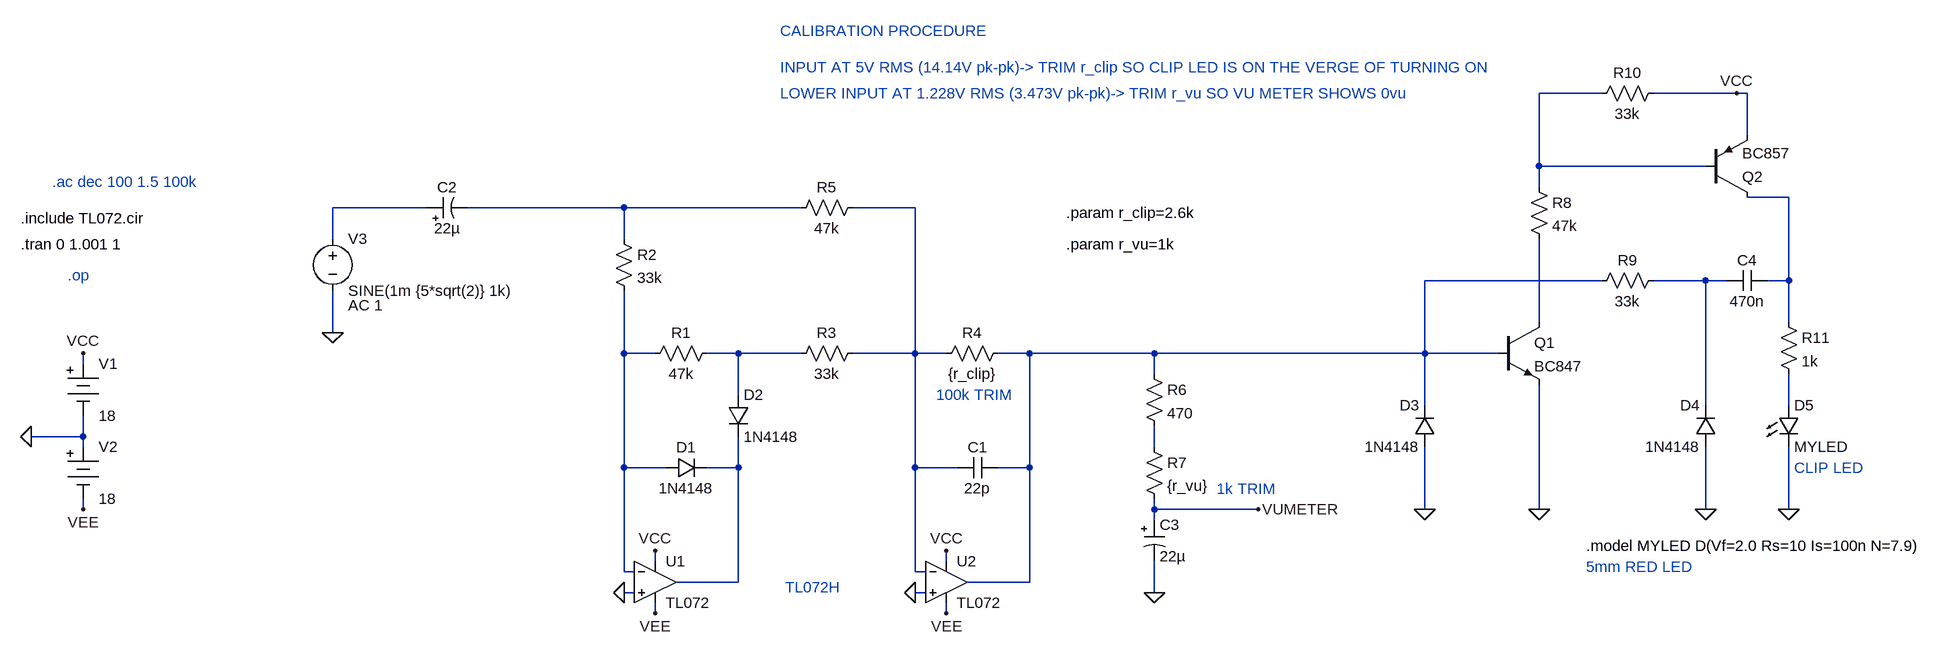
[diagram p0: schematic sig_peak_vumeter.asc]
sig_peak_vumeter.asc, the LTspice schematic file:
Version 4
SHEET 1 3308 796
WIRE 2368 -80 2272 -80
WIRE 2576 -80 2448 -80
WIRE 2592 -80 2576 -80
WIRE 2592 -16 2592 -80
WIRE 2272 32 2272 -80
WIRE 2528 32 2272 32
WIRE 2272 64 2272 32
WIRE 2656 80 2592 80
WIRE 560 96 416 96
WIRE 864 96 624 96
WIRE 1136 96 864 96
WIRE 1312 96 1216 96
WIRE 416 144 416 96
WIRE 864 144 864 96
WIRE 2368 208 2096 208
WIRE 2528 208 2448 208
WIRE 2560 208 2528 208
WIRE 2656 208 2656 80
WIRE 2656 208 2624 208
WIRE 2272 272 2272 144
WIRE 2656 272 2656 208
WIRE 416 288 416 224
WIRE 864 320 864 224
WIRE 912 320 864 320
WIRE 1040 320 992 320
WIRE 1136 320 1040 320
WIRE 1312 320 1312 96
WIRE 1312 320 1216 320
WIRE 1360 320 1312 320
WIRE 1488 320 1440 320
WIRE 1680 320 1488 320
WIRE 2096 320 2096 208
WIRE 2096 320 1680 320
WIRE 2208 320 2096 320
WIRE 32 336 32 320
WIRE 1680 352 1680 320
WIRE 1040 384 1040 320
WIRE 2096 400 2096 320
WIRE 2528 400 2528 208
WIRE 2656 400 2656 352
WIRE 32 448 32 416
WIRE 32 448 -48 448
WIRE 32 464 32 448
WIRE 1680 464 1680 432
WIRE 864 496 864 320
WIRE 928 496 864 496
WIRE 1040 496 1040 448
WIRE 1040 496 992 496
WIRE 1312 496 1312 320
WIRE 1376 496 1312 496
WIRE 1488 496 1488 320
WIRE 1488 496 1440 496
WIRE 32 560 32 544
WIRE 1680 560 1680 544
WIRE 1840 560 1680 560
WIRE 2096 560 2096 464
WIRE 2272 560 2272 368
WIRE 2528 560 2528 464
WIRE 2656 560 2656 464
WIRE 1680 576 1680 560
WIRE 912 640 912 624
WIRE 1360 640 1360 624
WIRE 864 656 864 496
WIRE 880 656 864 656
WIRE 1312 656 1312 496
WIRE 1328 656 1312 656
WIRE 1040 672 1040 496
WIRE 1040 672 944 672
WIRE 1488 672 1488 496
WIRE 1488 672 1392 672
WIRE 880 688 864 688
WIRE 1328 688 1312 688
WIRE 1680 688 1680 640
WIRE 912 720 912 704
WIRE 1360 720 1360 704
FLAG 32 320 VCC
FLAG -48 448 0
FLAG 32 560 VEE
FLAG 416 288 0
FLAG 912 624 VCC
FLAG 912 720 VEE
FLAG 864 688 0
FLAG 1360 624 VCC
FLAG 1360 720 VEE
FLAG 1312 688 0
FLAG 1680 688 0
FLAG 1840 560 VUMETER
FLAG 2096 560 0
FLAG 2272 560 0
FLAG 2528 560 0
FLAG 2656 560 0
FLAG 2576 -80 VCC
SYMBOL Misc/battery 32 320 R0
SYMATTR InstName V1
SYMATTR Value 18
SYMBOL Misc/battery 32 448 R0
SYMATTR InstName V2
SYMATTR Value 18
SYMBOL Voltage 416 128 R0
WINDOW 123 24 118 Left 2
SYMATTR InstName V3
SYMATTR Value SINE(1m {5*sqrt(2)} 1k)
SYMATTR Value2 AC 1
SYMBOL OpAmps/opamp2 912 608 R0
SYMATTR InstName U1
SYMATTR Value TL072
SYMBOL Diode 928 512 R270
WINDOW 0 32 32 VTop 2
WINDOW 3 0 32 VBottom 2
SYMATTR InstName D1
SYMATTR Value 1N4148
SYMBOL Diode 1024 384 R0
SYMATTR InstName D2
SYMATTR Value 1N4148
SYMBOL Res 1008 304 R90
WINDOW 0 0 56 VBottom 2
WINDOW 3 32 56 VTop 2
SYMATTR InstName R1
SYMATTR Value 47k
SYMBOL Res 848 128 R0
SYMATTR InstName R2
SYMATTR Value 33k
SYMBOL Res 1232 304 R90
WINDOW 0 0 56 VBottom 2
WINDOW 3 32 56 VTop 2
SYMATTR InstName R3
SYMATTR Value 33k
SYMBOL OpAmps/opamp2 1360 608 R0
SYMATTR InstName U2
SYMATTR Value TL072
SYMBOL Cap 1440 480 R90
WINDOW 0 0 32 VBottom 2
WINDOW 3 32 32 VTop 2
SYMATTR InstName C1
SYMATTR Value 22p
SYMBOL Res 1456 304 R90
WINDOW 0 0 56 VBottom 2
WINDOW 3 32 56 VTop 2
SYMATTR InstName R4
SYMATTR Value {r_clip}
SYMBOL Res 1232 80 R90
WINDOW 0 0 56 VBottom 2
WINDOW 3 32 56 VTop 2
SYMATTR InstName R5
SYMATTR Value 47k
SYMBOL Res 1664 336 R0
SYMATTR InstName R6
SYMATTR Value 470
SYMBOL polcap 1664 576 R0
SYMATTR InstName C3
SYMATTR Value 22µ
SYMBOL Res 1664 448 R0
SYMATTR InstName R7
SYMATTR Value {r_vu}
SYMBOL Diode 2112 464 R180
WINDOW 0 24 64 Left 2
WINDOW 3 24 0 Left 2
SYMATTR InstName D3
SYMATTR Value 1N4148
SYMBOL npn 2208 272 R0
SYMATTR InstName Q1
SYMATTR Value BC847
SYMBOL Res 2256 48 R0
SYMATTR InstName R8
SYMATTR Value 47k
SYMBOL Res 2464 192 R90
WINDOW 0 0 56 VBottom 2
WINDOW 3 32 56 VTop 2
SYMATTR InstName R9
SYMATTR Value 33k
SYMBOL Diode 2544 464 R180
WINDOW 0 24 64 Left 2
WINDOW 3 24 0 Left 2
SYMATTR InstName D4
SYMATTR Value 1N4148
SYMBOL pnp 2528 80 M180
SYMATTR InstName Q2
SYMATTR Value BC857
SYMBOL Res 2464 -96 R90
WINDOW 0 0 56 VBottom 2
WINDOW 3 32 56 VTop 2
SYMATTR InstName R10
SYMATTR Value 33k
SYMBOL Cap 2624 192 R90
WINDOW 0 0 32 VBottom 2
WINDOW 3 32 32 VTop 2
SYMATTR InstName C4
SYMATTR Value 470n
SYMBOL Res 2640 256 R0
SYMATTR InstName R11
SYMATTR Value 1k
SYMBOL LED 2640 400 R0
SYMATTR InstName D5
SYMATTR Value MYLED
SYMBOL polcap 560 112 R270
WINDOW 0 32 32 VTop 2
WINDOW 3 0 32 VBottom 2
SYMATTR InstName C2
SYMATTR Value 22µ
TEXT -64 112 Left 2 !.include TL072.cir
TEXT -64 152 Left 2 !.tran 0 1.001 1
TEXT 1344 384 Left 2 ;100k TRIM
TEXT 1776 528 Left 2 ;1k TRIM
TEXT 2344 616 Left 2 !.model MYLED D(Vf=2.0 Rs=10 Is=100n N=7.9)
TEXT 8 200 Left 2 ;.op
TEXT 2344 648 Left 2 ;5mm RED LED
TEXT 1544 104 Left 2 !.param r_clip=2.6k
TEXT 1544 152 Left 2 !.param r_vu=1k
TEXT 1104 -120 Left 2 ;INPUT AT 5V RMS (14.14V pk-pk)-> TRIM r_clip SO CLIP LED IS ON THE VERGE OF TURNING ON
TEXT 1104 -80 Left 2 ;LOWER INPUT AT 1.228V RMS (3.473V pk-pk)-> TRIM r_vu SO VU METER SHOWS 0vu
TEXT 1104 -176 Left 2 ;CALIBRATION PROCEDURE
TEXT 2664 496 Left 2 ;CLIP LED
TEXT 1112 680 Left 2 ;TL072H
TEXT -16 56 Left 2 ;.ac dec 100 1.5 100k

The netlist it stands for:
* sig_peak_vumeter.asc
V1 VCC 0 18
V2 0 VEE 18
V3 N003 0 SINE(1m {5*sqrt(2)} 1k) AC 1
XU1 0 N009 VCC VEE N013 TL072  ; pins In+ In- V+ V- OUT
D1 N009 N013 1N4148
D2 N010 N013 1N4148
R1 N010 N009 47k
R2 N004 N009 33k
R3 N005 N010 33k
XU2 0 N005 VCC VEE N006 TL072  ; pins In+ In- V+ V- OUT
C1 N006 N005 22p
R4 N006 N005 {r_clip}
R5 N005 N004 47k
R6 N006 N012 470
C3 VUMETER 0 22µ
R7 N012 VUMETER {r_vu}
D3 0 N006 1N4148
Q1 N008 N006 0 0 BC847
R8 N001 N008 47k
R9 N007 N006 33k
D4 0 N007 1N4148
Q2 N002 N001 VCC 0 BC857
R10 VCC N001 33k
C4 N002 N007 470n
R11 N002 N011 1k
D5 N011 0 MYLED
C2 N003 N004 22µ
.model D D
.lib standard.dio
.model NPN NPN
.model PNP PNP
.lib standard.bjt
.include TL072.cir
.tran 0 1.001 1
* 100k TRIM
* 1k TRIM
.model MYLED D(Vf=2.0 Rs=10 Is=100n N=7.9)
* .op
* 5mm RED LED
.param r_clip=2.6k
.param r_vu=1k
* INPUT AT 5V RMS (14.14V pk-pk)-> TRIM r_clip SO CLIP LED IS ON THE VERGE OF TURNING ON
* LOWER INPUT AT 1.228V RMS (3.473V pk-pk)-> TRIM r_vu SO VU METER SHOWS 0vu
* CALIBRATION PROCEDURE
* CLIP LED
* TL072H
* .ac dec 100 1.5 100k
.backanno
.end